# Altium schematic sheet Main.SchDoc
size 420 x 297 mm; Address1: Address1; Address2: Address2; Address3: Address3; Address4: Address4; SheetNumber: 1; Scale: 1:1; Разраб.: Иванов; Обозначение документа: АБВГ.123456.001 Э3; Пров.: Петров; Утв.: Сидоров; Наименование организации: ОАО "Концерн "МПО-Гидроприбор"; Перв. применение: АБВГ.123456.000; Наименование изделия 1: Плата; Наименование изделия 2: Схема электрическая; Наименование изделия 3: принципиальная; Нач. отд.: Нач. отд.; Фамилия нач. отд.: Сидоров
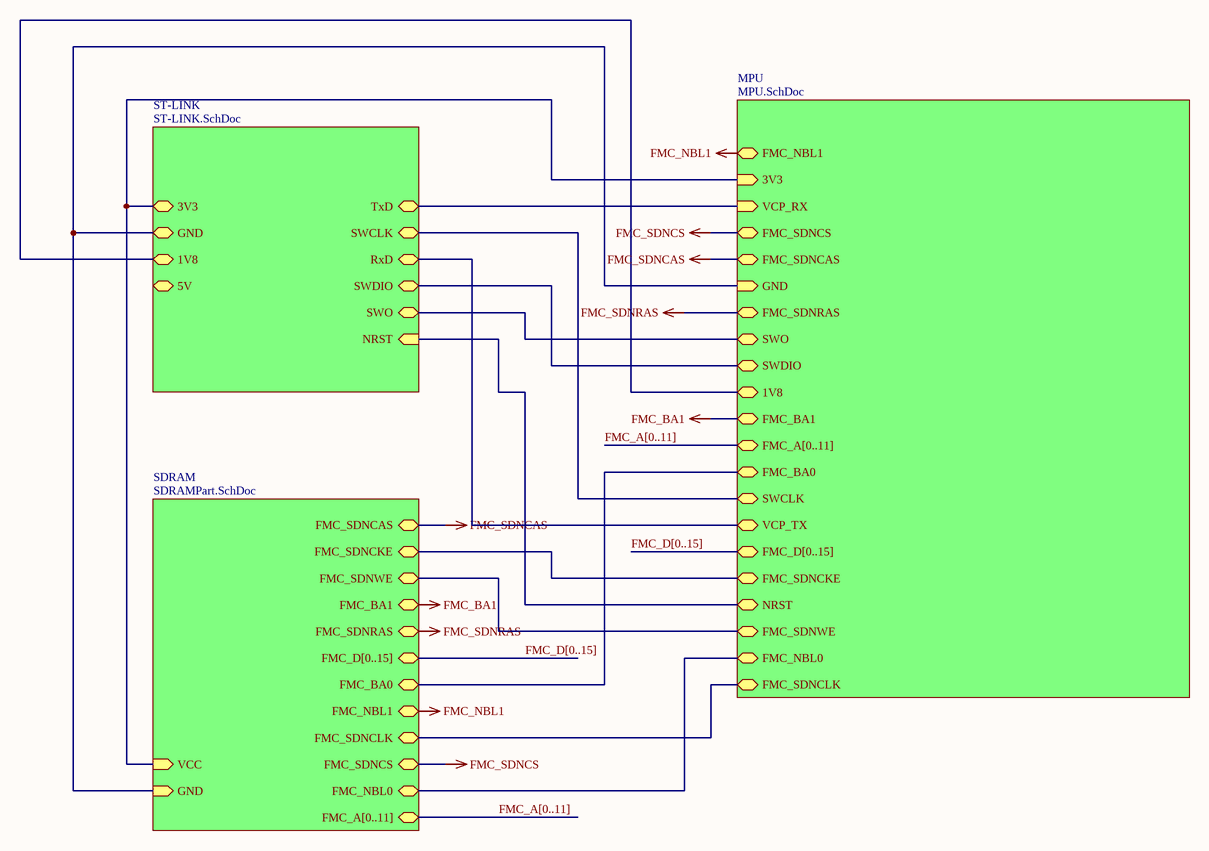
[diagram p0: Main.SchDoc]

## Sub-sheets
MPU = MPU.SchDoc: FMC_NBL1 (bidir), 3V3 (in), VCP_RX (in), FMC_SDNCS (bidir), FMC_SDNCAS (bidir), GND (in), FMC_SDNRAS (bidir), SWO, SWDIO, 1V8, FMC_BA1 (bidir), FMC_A[0..11] (bidir), FMC_BA0 (bidir), SWCLK, VCP_TX, FMC_D[0..15] (bidir), FMC_SDNCKE (bidir), NRST, FMC_SDNWE (bidir), FMC_NBL0 (bidir), FMC_SDNCLK (bidir)
SDRAM = SDRAMPart.SchDoc: FMC_SDNCAS (bidir), FMC_SDNCKE (bidir), FMC_SDNWE (bidir), FMC_BA1 (bidir), FMC_SDNRAS (bidir), FMC_D[0..15] (bidir), FMC_BA0 (bidir), FMC_NBL1 (bidir), FMC_SDNCLK (bidir), FMC_SDNCS (bidir), FMC_NBL0 (bidir), FMC_A[0..11] (bidir), VCC (in), GND (in)
ST-LINK = ST-LINK.SchDoc: TxD (bidir), SWCLK (bidir), RxD (bidir), SWDIO (bidir), SWO (bidir), NRST (in), 3V3 (bidir), GND (bidir), 1V8 (bidir), 5V (bidir)

## Nets
FMC_BA1: sheet MPU/FMC_BA1, sheet SDRAM/FMC_BA1
FMC_NBL1: sheet MPU/FMC_NBL1, sheet SDRAM/FMC_NBL1
FMC_SDNCAS: sheet MPU/FMC_SDNCAS, sheet SDRAM/FMC_SDNCAS
FMC_SDNCS: sheet MPU/FMC_SDNCS, sheet SDRAM/FMC_SDNCS
FMC_SDNRAS: sheet MPU/FMC_SDNRAS, sheet SDRAM/FMC_SDNRAS
(unnamed): sheet MPU/3V3, sheet ST-LINK/3V3, sheet SDRAM/VCC
(unnamed): sheet MPU/VCP_RX, sheet ST-LINK/TxD
(unnamed): sheet MPU/GND, sheet ST-LINK/GND, sheet SDRAM/GND
(unnamed): sheet MPU/SWO, sheet ST-LINK/SWO
(unnamed): sheet MPU/SWDIO, sheet ST-LINK/SWDIO
(unnamed): sheet MPU/1V8, sheet ST-LINK/1V8
(unnamed): sheet MPU/FMC_BA0, sheet SDRAM/FMC_BA0
(unnamed): sheet MPU/SWCLK, sheet ST-LINK/SWCLK
(unnamed): sheet MPU/VCP_TX, sheet ST-LINK/RxD
(unnamed): sheet MPU/FMC_SDNCKE, sheet SDRAM/FMC_SDNCKE
(unnamed): sheet MPU/NRST, sheet ST-LINK/NRST
(unnamed): sheet MPU/FMC_SDNWE, sheet SDRAM/FMC_SDNWE
(unnamed): sheet MPU/FMC_NBL0, sheet SDRAM/FMC_NBL0
(unnamed): sheet MPU/FMC_SDNCLK, sheet SDRAM/FMC_SDNCLK

## Buses and harness runs
bus FMC_A[0..11] = sheet MPU/FMC_A[0..11]
bus FMC_A[0..11] = sheet SDRAM/FMC_A[0..11]
bus FMC_D[0..15] = sheet MPU/FMC_D[0..15]
bus FMC_D[0..15] = sheet SDRAM/FMC_D[0..15]

## Notes on the sheet
- Перв. примен.
- Справ. №
- Подп. и дата
- Инв. № дубл.
- Взам. инв. №
- Разраб.
- Изм.
- Лист
- № докум.
- Подп.
- Дата
- Лит.
- Масса
- Масштаб
- Пров.
- Т.контр.
- Листов
- Инв. № подл.
- Утв.
- Н.контр.
- Копировал
- Формат А3